# EAGLE schematic Example for libraries reference (EAGLE 9.6.2)
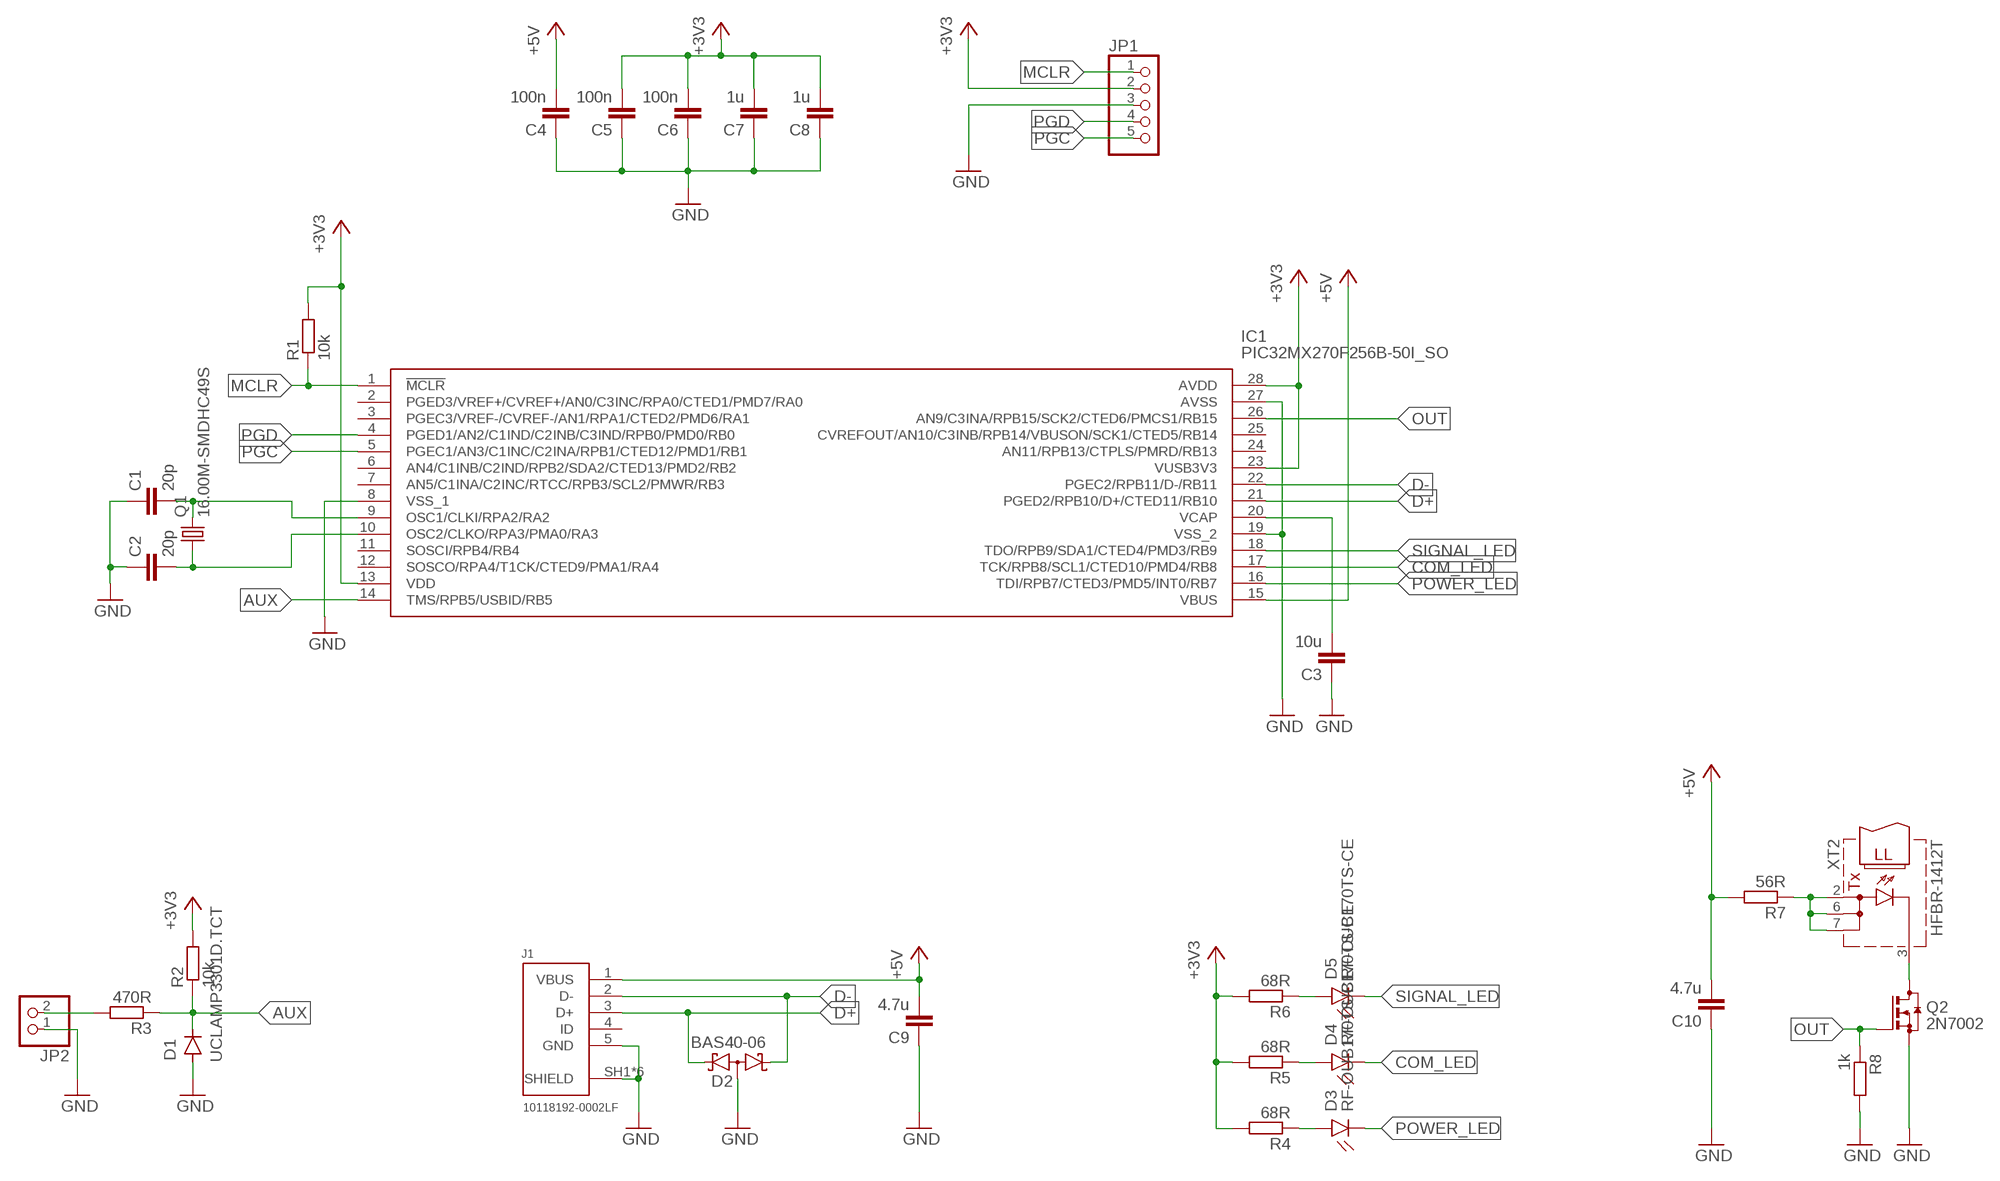
[diagram p0: schematic, sheet 1]

## Parts
C1  20p  C-EUC0805  [C0805]
C2  20p  C-EUC0805  [C0805]
C3  10u  C-EUC0805  [C0805]
C4  100n  C-EUC0805  [C0805]
C5  100n  C-EUC0805  [C0805]
C6  100n  C-EUC0805  [C0805]
C7  1u  C-EUC0805  [C0805]
C8  1u  C-EUC0805  [C0805]
C9  4.7u  C-EUC0805  [C0805]
C10  4.7u  C-EUC0805  [C0805]
D1  UCLAMP3301D.TCT  1N4148WS  [SOD-323]
D2  BAS40-06  [SOT23]
D3  RF-OUB170TS-CE  CHIP-FLAT-B_0805  [LEDC2012X110N_FLAT-B]
D4  RF-OUB170TS-CE  CHIP-FLAT-B_0805  [LEDC2012X110N_FLAT-B]
D5  RF-OUB170TS-CE  CHIP-FLAT-B_0805  [LEDC2012X110N_FLAT-B]
IC1  PIC32MX270F256B-50I_SO  [SOIC127P1030X265-28N]
J1  10118192-0002LF  [10118192-0002LF]
JP1  PINHD-1X5  [1X05]
JP2  PINHD-1X2  [1X02]
Q1  16.00M-SMDHC49S  CRYSTALSM49  [SM49]
Q2  2N7002  BSS123  [SOT23]
R1  10k  R-EU_R0805  [R0805]
R2  10k  R-EU_R0805  [R0805]
R3  470R  R-EU_R0805  [R0805]
R4  68R  R-EU_R0805  [R0805]
R5  68R  R-EU_R0805  [R0805]
R6  68R  R-EU_R0805  [R0805]
R7  56R  R-EU_R0805  [R0805]
R8  1k  R-EU_R0805  [R0805]
XT2  HFBR-1412T  [HFBR-X41XT]

## Nets
+3V3: C5.2 C6.2 C7.2 C8.2 IC1.13(VDD) IC1.23(VUSB3V3) IC1.28(AVDD) JP1.2 R1.2 R2.2 R4.2 R5.2 R6.2
+5V: C4.2 C9.2 C10.2 IC1.15(VBUS) J1.1(VBUS) R7.2
AUX: D1.C IC1.14(TMS/RPB5/USBID/RB5) R2.1 R3.1
COM_LED: D4.C IC1.17(TCK/RPB8/SCL1/CTED10/PMD4/RB8)
D+: D2.2(K2) IC1.21(PGED2/RPB10/D+/CTED11/RB10) J1.3(D+)
D-: D2.1(K1) IC1.22(PGEC2/RPB11/D-/RB11) J1.2(D-)
GND: C1.1 C2.1 C3.1 C4.1 C5.1 C6.1 C7.1 C8.1 C9.1 C10.1 D1.A D2.3(AA) IC1.8(VSS_1) IC1.19(VSS_2) IC1.27(AVSS) J1.5(GND) J1.SH1(SHIELD) J1.SH2(SHIELD) J1.SH3(SHIELD) J1.SH4(SHIELD) J1.SH5(SHIELD) J1.SH6(SHIELD) JP1.3 JP2.1 Q2.2(S) R8.2
MCLR: IC1.1(!MCLR) JP1.1 R1.1
N$1: C1.2 IC1.9(OSC1/CLKI/RPA2/RA2) Q1.2
N$2: C2.2 IC1.10(OSC2/CLKO/RPA3/PMA0/RA3) Q1.1
N$3: C3.2 IC1.20(VCAP)
N$4: R7.1 XT2.2(A) XT2.6(A1) XT2.7(A2)
N$5: Q2.3(D) XT2.3(C)
N$7: JP2.2 R3.2
N$8: D3.A R4.1
N$9: D4.A R5.1
N$10: D5.A R6.1
OUT: IC1.26(AN9/C3INA/RPB15/SCK2/CTED6/PMCS1/RB15) Q2.1(G) R8.1
PGC: IC1.5(PGEC1/AN3/C1INC/C2INA/RPB1/CTED12/PMD1/RB1) JP1.5
PGD: IC1.4(PGED1/AN2/C1IND/C2INB/C3IND/RPB0/PMD0/RB0) JP1.4
POWER_LED: D3.C IC1.16(TDI/RPB7/CTED3/PMD5/INT0/RB7)
SIGNAL_LED: D5.C IC1.18(TDO/RPB9/SDA1/CTED4/PMD3/RB9)
Unconnected: IC1.2(PGED3/VREF+/CVREF+/AN0/C3INC/RPA0/CTED1/PMD7/RA0) IC1.3(PGEC3/VREF-/CVREF-/AN1/RPA1/CTED2/PMD6/RA1) IC1.6(AN4/C1INB/C2IND/RPB2/SDA2/CTED13/PMD2/RB2) IC1.7(AN5/C1INA/C2INC/RTCC/RPB3/SCL2/PMWR/RB3) IC1.11(SOSCI/RPB4/RB4) IC1.12(SOSCO/RPA4/T1CK/CTED9/PMA1/RA4) IC1.24(AN11/RPB13/CTPLS/PMRD/RB13) IC1.25(CVREFOUT/AN10/C3INB/RPB14/VBUSON/SCK1/CTED5/RB14) J1.4(ID)

## Library data of the parts
C1-C10 = rcl:C-EU: CAPACITOR, European symbol; SPICEPREFIX: C
D1 = Diodes:1N4148WS: DIODE GEN PURP 75V 150MA SOD323F Manufacturer's datasheet <https://www.onsemi.com/pub/Collateral/1N914BWS-D.pdf>; CREATED_BY: PCBLayout.com; DIGIKEY_PART_NUMBER: 1N4148WSFSTR-ND; MANUFACTURER: Diodes Incorporated; MPN: 1N4148WS; PACKAGE: SOD-323
D2 = diode:BAS40-06: Silicon Schottky Diodes General-purpose diode for high-speed switching
D3-D5 = LED:CHIP-FLAT-B; CATEGORY: LED; COLOR: BLUE; DESCRIPTION: CHIP LED FLAT; SUB-CATEGORY: CHIP; TYPE: FLAT_TOP; VALUE: LED_BLUE
IC1 = SamacSys_Parts:PIC32MX270F256B-50I_SO: 32-bit Microcontrollers - MCU 256KB Flash 64KB RAM 50MHz, 10-bit ADC Source: Datasheet <https://componentsearchengine.com/Datasheets/1/PIC32MX270F256B-50I_SO.pdf>; DESCRIPTION: 32-bit Microcontrollers - MCU 256KB Flash 64KB RAM 50MHz, 10-bit ADC; HEIGHT: 2.65mm; MANUFACTURER_NAME: Microchip; MANUFACTURER_PART_NUMBER: PIC32MX270F256B-50I/SO; MOUSER_PART_NUMBER: 579-32MX270F256B5ISO; MOUSER_PRICE-STOCK: https://www.mouser.co.uk/ProductDetail/Microchip-Technology/PIC32MX270F256B-50I-SO?qs=PQDAUpz3sUNnli2cSwHtUA%3D%3D
J1 = USB connector:10118192-0002LF: CONN RCPT USB2.0 MICRO B SMD R/A Manufacturer's datasheet <https://www.amphenol-icc.com/media/wysiwyg/files/drawing/10118192.pdf>; CREATED_BY: PCBLayout.com; DIGIKEY_PARTNO: 609-5379-2-ND; MANUFACTURER: Amphenol ICC (FCI); MPN: 10118192-0002LF
JP1 = pinhead:PINHD-1X5: PIN HEADER
JP2 = pinhead:PINHD-1X2: PIN HEADER
Q1 = crystal:CRYSTAL: CRYSTAL; OC_FARNELL: unknown; OC_NEWARK: unknown
Q2 = transistor-small-signal:BSS123: N-CHANNEL MOS FET
R1-R8 = rcl:R-EU_: RESISTOR, European symbol; SPICEPREFIX: R
XT2 = fiber-optic-hp:HFBR-1412T: TRANSMITTER low cost miniature fiber optic component, 5-MBd high performance link, vertical; MF: AGILENT TECHNOLOGIES; MPN: HFBR-1412T; OC_FARNELL: 1247625; OC_NEWARK: 06F6039